# Altium project MASTER_HW.PrjPcb (part 3 of 4)

## Sheet [2] MCU.SchDoc
size A4; DocumentNumber: 2; SheetNumber: 3; SheetTotal: 10
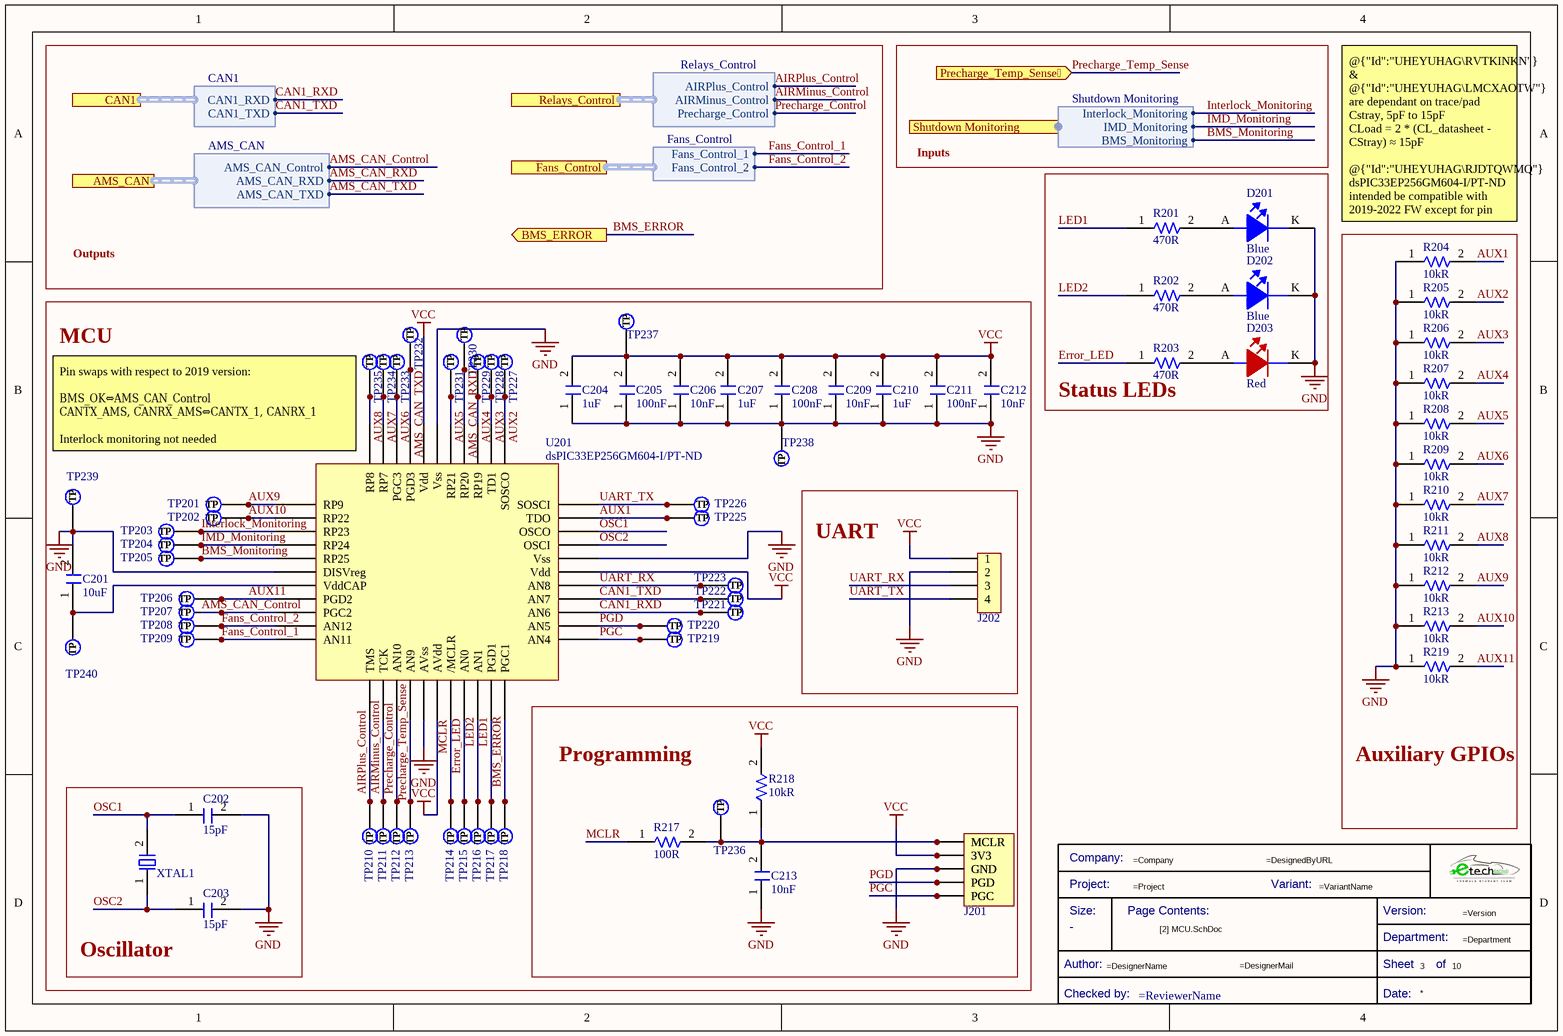
[diagram p3: [2] MCU.SchDoc]

### Parts
(Parts that share a designator on the sheet are numbered #1, #2 ... from top to bottom, then left to right.)
*#3  Title Block_template  (value not drawn)  (graphical)
C201  Capacitance: 10uF  [C1206FNPC-RW]  (hidden comment: 885012208018)
C202  Capacitance: 15pF  [C0805FNPC-R]  (hidden comment: 885012007052)
C203  Capacitance: 15pF  [C0805FNPC-R]  (hidden comment: 885012007052)
C204  Capacitance: 1uF  [C0805FNPC-R]  (hidden comment: 885012207103)
C205  Capacitance: 100nF  [C0805FNPC-R]  (hidden comment: 885012207098)
C206  Capacitance: 10nF  [C0805FNPC-R]  (hidden comment: 885012207092)
C207  Capacitance: 1uF  [C0805FNPC-R]  (hidden comment: 885012207103)
C208  Capacitance: 100nF  [C0805FNPC-R]  (hidden comment: 885012207098)
C209  Capacitance: 10nF  [C0805FNPC-R]  (hidden comment: 885012207092)
C210  Capacitance: 1uF  [C0805FNPC-R]  (hidden comment: 885012207103)
C211  Capacitance: 100nF  [C0805FNPC-R]  (hidden comment: 885012207098)
C212  Capacitance: 10nF  [C0805FNPC-R]  (hidden comment: 885012207092)
C213  Capacitance: 10nF  [C0805FNPC-R]  (hidden comment: 885012207092)
D201  Color: Blue  [LED_0805_WE]  (hidden comment: 150080BS75000)
D202  Color: Blue  [LED_0805_WE]  (hidden comment: 150080BS75000)
D203  Color: Red  [LED_0805_WE]  (hidden comment: 150080RS75000)
J201  61300511121  [J_PinHeader_1x5]  (value not drawn)
J202  61300411121  [J_PinHeader_1x4]  (value not drawn)
R201  Resistance: 470R  [R0805FTK]  (hidden comment: CR0805-FX-4700GLF)
R202  Resistance: 470R  [R0805FTK]  (hidden comment: CR0805-FX-4700GLF)
R203  Resistance: 470R  [R0805FTK]  (hidden comment: CR0805-FX-4700GLF)
R204  Resistance: 10kR  [R0805FTK]  (hidden comment: CR0805-JW-103ELF)
R205  Resistance: 10kR  [R0805FTK]  (hidden comment: CR0805-JW-103ELF)
R206  Resistance: 10kR  [R0805FTK]  (hidden comment: CR0805-JW-103ELF)
R207  Resistance: 10kR  [R0805FTK]  (hidden comment: CR0805-JW-103ELF)
R208  Resistance: 10kR  [R0805FTK]  (hidden comment: CR0805-JW-103ELF)
R209  Resistance: 10kR  [R0805FTK]  (hidden comment: CR0805-JW-103ELF)
R210  Resistance: 10kR  [R0805FTK]  (hidden comment: CR0805-JW-103ELF)
R211  Resistance: 10kR  [R0805FTK]  (hidden comment: CR0805-JW-103ELF)
R212  Resistance: 10kR  [R0805FTK]  (hidden comment: CR0805-JW-103ELF)
R213  Resistance: 10kR  [R0805FTK]  (hidden comment: CR0805-JW-103ELF)
R217  Resistance: 100R  [R0805FTK]  (hidden comment: CR0805-FX-1000ELF)
R218  Resistance: 10kR  [R0805FTK]  (hidden comment: CR0805-JW-103ELF)
R219  Resistance: 10kR  [R0805FTK]  (hidden comment: CR0805-JW-103ELF)
TP201  TestPoint  [TestPoint]  (value not drawn)  (no BOM)
TP202  TestPoint  [TestPoint]  (value not drawn)  (no BOM)
TP203  TestPoint  [TestPoint]  (value not drawn)  (no BOM)
TP204  TestPoint  [TestPoint]  (value not drawn)  (no BOM)
TP205  TestPoint  [TestPoint]  (value not drawn)  (no BOM)
TP206  TestPoint  [TestPoint]  (value not drawn)  (no BOM)
TP207  TestPoint  [TestPoint]  (value not drawn)  (no BOM)
TP208  TestPoint  [TestPoint]  (value not drawn)  (no BOM)
TP209  TestPoint  [TestPoint]  (value not drawn)  (no BOM)
TP210  TestPoint  [TestPoint]  (value not drawn)  (no BOM)
TP211  TestPoint  [TestPoint]  (value not drawn)  (no BOM)
TP212  TestPoint  [TestPoint]  (value not drawn)  (no BOM)
TP213  TestPoint  [TestPoint]  (value not drawn)  (no BOM)
TP214  TestPoint  [TestPoint]  (value not drawn)  (no BOM)
TP215  TestPoint  [TestPoint]  (value not drawn)  (no BOM)
TP216  TestPoint  [TestPoint]  (value not drawn)  (no BOM)
TP217  TestPoint  [TestPoint]  (value not drawn)  (no BOM)
TP218  TestPoint  [TestPoint]  (value not drawn)  (no BOM)
TP219  TestPoint  [TestPoint]  (value not drawn)  (no BOM)
TP220  TestPoint  [TestPoint]  (value not drawn)  (no BOM)
TP221  TestPoint  [TestPoint]  (value not drawn)  (no BOM)
TP222  TestPoint  [TestPoint]  (value not drawn)  (no BOM)
TP223  TestPoint  [TestPoint]  (value not drawn)  (no BOM)
TP225  TestPoint  [TestPoint]  (value not drawn)  (no BOM)
TP226  TestPoint  [TestPoint]  (value not drawn)  (no BOM)
TP227  TestPoint  [TestPoint]  (value not drawn)  (no BOM)
TP228  TestPoint  [TestPoint]  (value not drawn)  (no BOM)
TP229  TestPoint  [TestPoint]  (value not drawn)  (no BOM)
TP230  TestPoint  [TestPoint]  (value not drawn)  (no BOM)
TP231  TestPoint  [TestPoint]  (value not drawn)  (no BOM)
TP232  TestPoint  [TestPoint]  (value not drawn)  (no BOM)
TP233  TestPoint  [TestPoint]  (value not drawn)  (no BOM)
TP234  TestPoint  [TestPoint]  (value not drawn)  (no BOM)
TP235  TestPoint  [TestPoint]  (value not drawn)  (no BOM)
TP236  TestPoint  [TestPoint]  (value not drawn)  (no BOM)
TP237  TestPoint  [TestPoint]  (value not drawn)  (no BOM)
TP238  TestPoint  [TestPoint]  (value not drawn)  (no BOM)
TP239  TestPoint  [TestPoint]  (value not drawn)  (no BOM)
TP240  TestPoint  [TestPoint]  (value not drawn)  (no BOM)
U201  Supplier Part Number 1: dsPIC33EP256GM604-I/PT-ND  [U_dsPIC33EP256GM604-I/PT]  (hidden comment: dsPIC33EP256GM604-I/PT)
XTAL1  830028710  [XTAL20M_SMD]  (value not drawn)

### Blocks framed on the sheet
Status LEDs: D201-D203 R201-R203
Auxiliary GPIOs: R204-R213 R219
MCU: C201 C204-C212 TP201-TP223 TP225-TP235 TP237-TP240 U201
UART: J202
Programming: C213 J201 R217 R218 TP236
Oscillator: C202 C203 XTAL1

### Ports
AMS_CAN (harness AMS_CAN), BMS_ERROR (out), CAN1 (harness CAN1), Fans_Control (harness Fans_Control), Precharge_Temp_Sense (in), Relays_Control (harness Relays_Control), Shutdown Monitoring (harness Shutdown Monitoring)

### Harnesses
CAN1: CAN1_RXD, CAN1_TXD
AMS_CAN: AMS_CAN_Control, AMS_CAN_RXD, AMS_CAN_TXD
Relays_Control: AIRMinus_Control, AIRPlus_Control, Precharge_Control
Fans_Control: Fans_Control_1, Fans_Control_2
Shutdown Monitoring: BMS_Monitoring, IMD_Monitoring, Interlock_Monitoring

### Nets
GND: C201.2 C202.2 C203.2 C204.1 C205.1 C206.1 C207.1 C208.1 C209.1 C210.1 C211.1 C212.1 C213.1 D201.K D202.K D203.K J201.3(GND) J202.2 R204.1 R205.1 R206.1 R207.1 R208.1 R209.1 R210.1 R211.1 R212.1 R213.1 R219.1 TP238.1(TP) TP239.1(TP) U201.6(DISVreg) U201.16(AVss) U201.29(Vss) U201.39(Vss)
VCC: C204.2 C205.2 C206.2 C207.2 C208.2 C209.2 C210.2 C211.2 C212.2 J201.2(3V3) J202.1 R218.2 TP237.1(TP) U201.17(AVdd) U201.28(Vdd) U201.40(Vdd)
AIRMinus_Control: TP211.1(TP) U201.13(TCK) ; port Relays_Control.AIRMinus_Control
AIRPlus_Control: TP210.1(TP) U201.12(TMS) ; port Relays_Control.AIRPlus_Control
AMS_CAN_Control: TP207.1(TP) U201.9(PGC2) ; port AMS_CAN.AMS_CAN_Control
AMS_CAN_RXD: TP230.1(TP) U201.37(RP20) ; port AMS_CAN.AMS_CAN_RXD
AMS_CAN_TXD: TP232.1(TP) U201.41(PGD3) ; port AMS_CAN.AMS_CAN_TXD
AUX1: R204.2 TP225.1(TP) U201.32(TDO)
AUX2: R205.2 TP227.1(TP) U201.34(SOSCO)
AUX3: R206.2 TP228.1(TP) U201.35(TD1)
AUX4: R207.2 TP229.1(TP) U201.36(RP19)
AUX5: R208.2 TP231.1(TP) U201.38(RP21)
AUX6: R209.2 TP233.1(TP) U201.42(PGC3)
AUX7: R210.2 TP234.1(TP) U201.43(RP7)
AUX8: R211.2 TP235.1(TP) U201.44(RP8)
AUX9: R212.2 TP201.1(TP) U201.1(RP9)
AUX10: R213.2 TP202.1(TP) U201.2(RP22)
AUX11: R219.2 TP206.1(TP) U201.8(PGD2)
BMS_ERROR: TP218.1(TP) U201.22(PGC1) ; port BMS_ERROR
BMS_Monitoring: TP205.1(TP) U201.5(RP25) ; port Shutdown Monitoring.BMS_Monitoring
CAN1_RXD: TP221.1(TP) U201.25(AN6) ; port CAN1.CAN1_RXD
CAN1_TXD: TP222.1(TP) U201.26(AN7) ; port CAN1.CAN1_TXD
Error_LED: R203.1 TP215.1(TP) U201.19(AN0)
Fans_Control_1: TP209.1(TP) U201.11(AN11) ; port Fans_Control.Fans_Control_1
Fans_Control_2: TP208.1(TP) U201.10(AN12) ; port Fans_Control.Fans_Control_2
IMD_Monitoring: TP204.1(TP) U201.4(RP24) ; port Shutdown Monitoring.IMD_Monitoring
Interlock_Monitoring: TP203.1(TP) U201.3(RP23) ; port Shutdown Monitoring.Interlock_Monitoring
LED1: R201.1 TP217.1(TP) U201.21(PGD1)
LED2: R202.1 TP216.1(TP) U201.20(AN1)
MCLR: R217.1 TP214.1(TP) U201.18(/MCLR)
OSC1: C202.1 U201.31(OSCO) XTAL1.2
OSC2: C203.1 U201.30(OSCI) XTAL1.1
PGC: J201.5(PGC) TP219.1(TP) U201.23(AN4)
PGD: J201.4(PGD) TP220.1(TP) U201.24(AN5)
Precharge_Control: TP212.1(TP) U201.14(AN10) ; port Relays_Control.Precharge_Control
Precharge_Temp_Sense: TP213.1(TP) U201.15(AN9) ; port Precharge_Temp_Sense
UART_RX: J202.3 TP223.1(TP) U201.27(AN8)
UART_TX: J202.4 TP226.1(TP) U201.33(SOSCI)
NetC201_1: C201.1 TP240.1(TP) U201.7(VddCAP)
NetC213_2: C213.2 J201.1(MCLR) R217.2 R218.1 TP236.1(TP)
NetD201_A: D201.A R201.2
NetD202_A: D202.A R202.2
NetD203_A: D203.A R203.2

### Notes on the sheet
- Inputs
- @{"Id":"UHEYUHAG\RVTKINKN"} & @{"Id":"UHEYUHAG\LMCXAOTW"} are dependant on trace/pad Cstray, 5pF to 15pF
  CLoad = 2 * (CL_datasheet - CStray) ≈ 15pF
  @{"Id":"UHEYUHAG\RJDTQWMQ"} dsPIC33EP256GM604-I/PT-ND intended be compatible with 2019-2022 FW except for pin swappings.
- Outputs
- Pin swaps with respect to 2019 version:
  BMS_OK⇔AMS_CAN_Control
  CANTX_AMS, CANRX_AMS⇔CANTX_1, CANRX_1
  Interlock monitoring not needed
- Title
- Size:
- Date:
- A4
- Number:
- Time:
- Revision:
- Sheet
- of
- File:
- (in symbol Title Block_template) Company:; Project:; Variant:; Size:; Page Contents:; Version:; Department:; Author:; Sheet; of; Checked by:; Date:

### Library data of the parts
*#3 = Title Block_template: Standard Title Block; Category: Title Block; Checked by:: =ReviewerName; Size: -
C201 = C10u-10V-1206FNPC-X7R: Cap, 10ΜF, 10V, 10%, X7R, 1206; Manufacturer 1: Wurth Electronics; .Creator: GP; Supplier 1: Digi-Key; Manufacturer Part Number 1: 885012208018; RoHS: Yes; Category: Ceramic Capacitors; Stock 1: 7; Pricing 1: 1=0,66000, 10=0,59800, 100=0,53600, 500=0,47400 (USD); Mount: Surface Mount; Case/Package: 1206; Case Code (Metric): 3216; Case Code (Imperial): 1206; Min Operating Temperature: -55°C; Max Operating Temperature: 125°C; Packaging: Tape and Reel; Voltage Rating: 10V; Tolerance: 10%; Length: 0.126inch; Width: 0.063inch; Thickness: 0.075inch; RoHS Compliant: Yes; ComponentLink1URL: http://www.farnell.com/datasheets/2031895.pdf?src-supplier=Farnell; ComponentLink1Description: http://www.farnell.com/datasheets/2031895.pdf?src-supplier=Farnell; ComponentLink2URL: https://katalog.we-online.de/pbs/datasheet/885012208018.pdf?src-supplier=Digi-Key; ComponentLink2Description: https://katalog.we-online.de/pbs/datasheet/885012208018.pdf?src-supplier=Digi-Key; ComponentLink3URL: http://www.farnell.com/datasheets/2031895.pdf?src-supplier=Newark; ComponentLink3Description: http://www.farnell.com/datasheets/2031895.pdf?src-supplier=Newark; Supplier Part Number 1: 732-7565-1-ND; ComponentLink4Description: Wurth Elektronik; ComponentLink4URL: https://www.we-online.com/catalog/en/WCAP-CSGP-10VDC?sq=885012208018#885012208018
C202 C203 = C15p-50V-0805FNPC-NP0: Cap, 15PF, 50V, 5%, C0G/NP0, 0805; Manufacturer 1: Wurth Electronics; .Creator: DR; Supplier 1: Newark; Manufacturer Part Number 1: 885012007052; RoHS: Yes; Category: Ceramic Capacitors; Stock 1: 815; Pricing 1: 1=0,10800, 10=0,05200, 25=0,05100, 50=0,04900, 100=0,04800, 250=0,04600, 500=0,04300 (USD); Mount: Surface Mount; Case/Package: 0805; Case Code (Metric): 2012; Case Code (Imperial): 0805; Min Operating Temperature: -55°C; Max Operating Temperature: 125°C; Packaging: Cut Tape; Voltage Rating: 50V; Tolerance: 5%; Length: 0.079inch; Width: 0.049inch; Thickness: 0.028inch; RoHS Compliant: Yes; ComponentLink1URL: http://www.farnell.com/datasheets/2031702.pdf?src-supplier=Farnell; ComponentLink1Description: http://www.farnell.com/datasheets/2031702.pdf?src-supplier=Farnell; ComponentLink2URL: http://katalog.we-online.de/pbs/datasheet/885012007052.pdf?src-supplier=Digi-Key; ComponentLink2Description: http://katalog.we-online.de/pbs/datasheet/885012007052.pdf?src-supplier=Digi-Key; ComponentLink3URL: https://katalog.we-online.de/pbs/datasheet/885012007052.pdf?src-supplier=Digi-Key; ComponentLink3Description: https://katalog.we-online.de/pbs/datasheet/885012007052.pdf?src-supplier=Digi-Key; Supplier Part Number 1: 15AC9316
C204 C207 C210 = C1u-50V-0805FNPC-X7R: Multilayer Ceramic Capacitor, Wcap-Csgp Series, 1 F, 10%, X7R, 50 V, 0805 [2012 Metric] Rohs Compliant: Yes; Manufacturer 1: Wurth Electronics; Voltage Rating: 50V; .Creator: GP; Supplier 1: RSComponents; Manufacturer Part Number 1: 885012207103; RoHS: Yes; Category: Ceramic Capacitors; Stock 1: 5100; Pricing 1: 50=0,27200, 250=0,25300, 500=0,22800, 1250=0,20100, 2500=0,17100 (GBP); Mount: Surface Mount; Case/Package: 0805; Case Code (Metric): 2012; Case Code (Imperial): 0805; Min Operating Temperature: -55°C; Max Operating Temperature: 85°C; Packaging: Cut Tape; Dielectric: X7R; Tolerance: 10%; Voltage Rating (DC): 50V; Length: 0.079inch; Width: 0.049inch; Thickness: 0.053inch; REACH SVHC: Unknown; RoHS Compliant: Yes; ComponentLink1URL: http://www.farnell.com/datasheets/1958501.pdf?src-supplier=Farnell; ComponentLink1Description: http://www.farnell.com/datasheets/1958501.pdf?src-supplier=Farnell; ComponentLink2URL: http://www.farnell.com/datasheets/1958501.pdf?src-supplier=Element14; ComponentLink2Description: http://www.farnell.com/datasheets/1958501.pdf?src-supplier=Element14; ComponentLink3URL: https://katalog.we-online.de/pbs/datasheet/885012107003.pdf?src-supplier=Digi-Key; ComponentLink3Description: https://katalog.we-online.de/pbs/datasheet/885012107003.pdf?src-supplier=Digi-Key; ComponentLink4URL: http://www.farnell.com/datasheets/1958501.pdf?src-supplier=Newark; ComponentLink4Description: http://www.farnell.com/datasheets/1958501.pdf?src-supplier=Newark; Supplier Part Number 1: 1813523
C205 C208 C211 = C100n-50V-0805FNPC-X7R: Cap, 0.1ΜF, 50V, 10%, X7R, 0805; Manufacturer 1: Wurth Electronics; .Creator: DR; Supplier 1: RSComponents; Manufacturer Part Number 1: 885012207098; RoHS: Yes; Category: Ceramic Capacitors; Stock 1: 8000; Pricing 1: 100=0,10200, 500=0,07100, 2000=0,06100 (GBP); Mount: Surface Mount; Case/Package: 0805; Case Code (Metric): 2012; Case Code (Imperial): 0805; Min Operating Temperature: -55°C; Max Operating Temperature: 125°C; Packaging: Cut Tape; Voltage Rating: 50V; Dielectric: X7R; Tolerance: 10%; Voltage Rating (DC): 50V; Length: 0.079inch; Width: 0.049inch; Thickness: 0.035inch; REACH SVHC: Unknown; RoHS Compliant: Yes; ComponentLink1URL: http://www.farnell.com/datasheets/1958498.pdf?src-supplier=Farnell; ComponentLink1Description: http://www.farnell.com/datasheets/1958498.pdf?src-supplier=Farnell; ComponentLink2URL: http://www.farnell.com/datasheets/1958498.pdf?src-supplier=Element14; ComponentLink2Description: http://www.farnell.com/datasheets/1958498.pdf?src-supplier=Element14; ComponentLink3URL: https://katalog.we-online.de/pbs/datasheet/885012207098.pdf?src-supplier=Digi-Key; ComponentLink3Description: https://katalog.we-online.de/pbs/datasheet/885012207098.pdf?src-supplier=Digi-Key; ComponentLink4URL: http://www.farnell.com/datasheets/1958498.pdf?src-supplier=Newark; ComponentLink4Description: http://www.farnell.com/datasheets/1958498.pdf?src-supplier=Newark; Supplier Part Number 1: 1813493
C206 C209 C212 C213 = C10n-50V-0805FNPC-X7R: Cap, 0.01ΜF, 50V, 10%, X7R, 0805; Manufacturer 1: Wurth Electronics; .Creator: DR; Supplier 1: RSComponents; Manufacturer Part Number 1: 885012207092; RoHS: Yes; Category: Ceramic Capacitors; Stock 1: 1; Pricing 1: 4000=0,03200, 12000=0,03100 (USD); Mount: Surface Mount; Case/Package: 0805; Case Code (Metric): 2012; Case Code (Imperial): 0805; Min Operating Temperature: -55°C; Max Operating Temperature: 125°C; Packaging: Cut Tape; Voltage Rating: 50V; Dielectric: X7R; Tolerance: 10%; Voltage Rating (DC): 50V; Length: 0.079inch; Width: 0.049inch; Thickness: 0.035inch; REACH SVHC: Unknown; RoHS Compliant: Yes; ComponentLink1URL: http://www.farnell.com/datasheets/1958497.pdf?src-supplier=Farnell; ComponentLink1Description: http://www.farnell.com/datasheets/1958497.pdf?src-supplier=Farnell; ComponentLink2URL: http://www.farnell.com/datasheets/1958497.pdf?src-supplier=Element14; ComponentLink2Description: http://www.farnell.com/datasheets/1958497.pdf?src-supplier=Element14; ComponentLink3URL: http://www.farnell.com/datasheets/1958497.pdf?src-supplier=Newark; ComponentLink3Description: http://www.farnell.com/datasheets/1958497.pdf?src-supplier=Newark; ComponentLink4URL: https://katalog.we-online.de/pbs/datasheet/885012207092.pdf?src-supplier=Digi-Key; ComponentLink4Description: https://katalog.we-online.de/pbs/datasheet/885012207092.pdf?src-supplier=Digi-Key; Supplier Part Number 1: 1813941
D201 D202 = LEDBS-0805-145: LED BLUE CLEAR 0805 SMD; Manufacturer 1: Wurth Electronics; Luminous Intensity: 145mcd; Viewing Angle: 140°; Forward Voltage: 3.2V; Wavelength: 470nm; Lens Style: Clear,Rectangular; Forward Current: 30mA; Test Current: 20mA; .Creator: GP; ComponentLink1Description: Datasheet; ComponentLink1URL: https://www.we-online.com/catalog/datasheet/150080BS75000.pdf; ComponentLink2Description: Where buy it; ComponentLink2URL: https://katalog.we-online.de/en/led/WL-SMCW/150080BS75000; Supplier 1: RSComponents; Manufacturer Part Number 1: 150080BS75000; RoHS: Yes; Category: LEDs; Stock 1: 7400; Pricing 1: 50=0,19300, 500=0,12900, 1000=0,12200, 2000=0,11700, 4000=0,11100 (USD); Mount: Surface Mount; Case/Package: 0805; Case Code (Metric): 2012; Case Code (Imperial): 0805; Min Operating Temperature: -40°C; Max Operating Temperature: 85°C; Package Quantity: 4000; Packaging: Tape and Reel; Dominant Wavelength: 470nm; Length: 2mm; Width: 1.25mm; Height: 0.7mm; REACH SVHC: Unknown; RoHS Compliant: Yes; Lead Free: Lead Free; ComponentLink3URL: https://datasheet.ciiva.com/23843/150080bs75000-23843251.pdf?src-supplier=Newark; ComponentLink3Description: https://datasheet.ciiva.com/23843/150080bs75000-23843251.pdf?src-supplier=Newark; ComponentLink4URL: https://datasheet.ciiva.com/22656/1740214-22656954.pdf?src-supplier=Element14; ComponentLink4Description: https://datasheet.ciiva.com/22656/1740214-22656954.pdf?src-supplier=Element14; ComponentLink5URL: https://datasheet.ciiva.com/29279/759433-da-01-en-chipled-0805-w-kl-blau-150080bs75000-29279203.pdf?src-supplier=Conrad; ComponentLink5Description: https://datasheet.ciiva.com/29279/759433-da-01-en-chipled-0805-w-kl-blau-150080bs75000-29279203.pdf?src-supplier=Conrad; ComponentLink6URL: https://datasheet.ciiva.com/29562/150080bs75000-29562922.pdf?src-supplier=Digi-Key; ComponentLink6Description: https://datasheet.ciiva.com/29562/150080bs75000-29562922.pdf?src-supplier=Digi-Key; ComponentLink7URL: https://datasheet.ciiva.com/29562/150080bs75000-29562923.pdf?src-supplier=Digi-Key; ComponentLink7Description: https://datasheet.ciiva.com/29562/150080bs75000-29562923.pdf?src-supplier=Digi-Key; Supplier Part Number 1: 8154228
D203 = LEDRS-0805-150: 0805(H=0.8mm) 红色 高亮 λD=625nm VF=2V IF=30mA PD=72mW; Manufacturer 1: Wurth Electronics; Luminous Intensity: 150mcd; Viewing Angle: 140°; Forward Voltage: 2V; Wavelength: 625nm; Lens Style: Clear,Rectangular; Forward Current: 30mA; Test Current: 20mA; .Creator: DR; ComponentLink1Description: Datasheet; ComponentLink1URL: https://www.we-online.com/catalog/datasheet/150080RS75000.pdf; ComponentLink2Description: Where buy it; ComponentLink2URL: https://katalog.we-online.de/en/led/WL-SMCW/150080RS75000; Supplier 1: RSComponents; Manufacturer Part Number 1: 150080RS75000; RoHS: Yes; Category: LEDs; Stock 1: 1; Pricing 1: 50=0,19300, 500=0,12900, 1000=0,12300, 2000=0,11700, 4000=0,11100 (USD); Mount: Surface Mount; Case/Package: 0805; Case Code (Metric): 2012; Case Code (Imperial): 0805; Min Operating Temperature: -40°C; Max Operating Temperature: 85°C; Package Quantity: 4000; Packaging: Tape and Reel; Dominant Wavelength: 625nm; Length: 2mm; Width: 1.25mm; Height: 0.7mm; REACH SVHC: Unknown; RoHS Compliant: Yes; ComponentLink3URL: https://datasheet.ciiva.com/22656/150080rs75000-22656961.pdf?src-supplier=Element14; ComponentLink3Description: https://datasheet.ciiva.com/22656/150080rs75000-22656961.pdf?src-supplier=Element14; ComponentLink4URL: https://datasheet.ciiva.com/29279/759435-da-01-en-chipled-0805-w-kl-rot-150080rs75000-29279032.pdf?src-supplier=Conrad; ComponentLink4Description: https://datasheet.ciiva.com/29279/759435-da-01-en-chipled-0805-w-kl-rot-150080rs75000-29279032.pdf?src-supplier=Conrad; Supplier Part Number 1: 8154225P
J201 = J_Pickit3: THT Vertical Pin Header WR-PHD, Pitch 2.54 mm, Single Row, 5 pins; Manufacturer: Molex; Temperature rating: -40° to +105°C; Category type: PCB-PCB; Maximum current: 3 A; Maximum voltage: 250 V AC; Connections: 1x5; Number of Positions: 5; Gender: Male; Connector Type: Male Pin; Pitch: 0.1inch; .Creator: GP; Category: Connector; ComponentLink1Description: Datasheet; ComponentLink1URL: https://www.we-online.com/catalog/datasheet/61300511121.pdf; ComponentLink2Description: Where buy it; ComponentLink2URL: https://www.we-online.com/catalog/en/PHD_2_54_THT_PIN_HEADER_6130XX11121?sq=61300511121&sp=https%3A%2F%2Fwww.we-online.com%2Fweb%2Fen%2Fwuerth_elektronik%2Fsearchpage.php%3Fsearch%3D61300511121#61300511121; Manufacturer part number: 61300511121; Supplier: Würth Elektronik; RoHS: *; Application: Charge program; Product name: Pin Header; Flammability: 94V-0; Orientation: vertical; Mount: Through hole; Supplier 1: Mouser; Stock 1: 1878; Pricing 1: 1=0,26000, 10=0,21600, 25=0,18000, 50=0,15000, 100=0,13700, 1000=0,12400, 10000=0,12400 (USD); Contact Plating: Gold; Contact Material: Copper; Color: Black; Number of Rows: 1; Packaging: Bulk; Termination: Solder; Number of Contacts: 5; Contact Mating Length: 0.236inch; REACH SVHC: Unknown; Lead Free: Lead Free; ComponentLink3URL: http://www.farnell.com/cad/1737268.pdf?src-supplier=Element14; ComponentLink3Description: http://www.farnell.com/cad/1737268.pdf?src-supplier=Element14; ComponentLink4URL: https://katalog.we-online.de/em/datasheet/6130xx11121.pdf?src-supplier=Digi-Key; ComponentLink4Description: https://katalog.we-online.de/em/datasheet/6130xx11121.pdf?src-supplier=Digi-Key; Supplier Part Number 1: 710-61300511121
J202 = J_UART: CONN HEADER 4 POS 2.54; Manufacturer 1: Wurth Electronics; Number of Positions: 4; Gender: Male; Connector Type: Male Pin; Pitch: 0.1inch; .Creator: AC; Supplier 1: RSComponents; Manufacturer Part Number 1: 61300411121; RoHS: Yes; Category: Headers and Wire Housings; Stock 1: 1; Pricing 1: 5=0,19500, 250=0,08000, 500=0,07700, 2500=0,07500, 5000=0,07200 (USD); Mount: Through Hole; Contact Plating: Gold; Contact Material: Copper; Color: Black; Number of Rows: 1; Packaging: Bulk; Termination: Solder; Number of Contacts: 4; Contact Mating Length: 0.236inch; REACH SVHC: Unknown; Lead Free: Lead Free; RoHS Compliant: Yes; ComponentLink1URL: http://www.farnell.com/cad/1737268.pdf?src-supplier=Element14; ComponentLink1Description: http://www.farnell.com/cad/1737268.pdf?src-supplier=Element14; ComponentLink2URL: https://katalog.we-online.de/em/datasheet/6130xx11121.pdf?src-supplier=Digi-Key; ComponentLink2Description: https://katalog.we-online.de/em/datasheet/6130xx11121.pdf?src-supplier=Digi-Key; Supplier Part Number 1: 8281594
R201-R203 = R470-0805FTK: Res Thick Film 0805 470 Ohm 1% 1/8W ±100ppm/°C Molded SMD SMD Paper Tape on Plastic Reel; Manufacturer 1: Bourns; Power Rating: 125mW; Voltage Rating: 150V; .Creator: DR; Supplier 1: Arrow Electronics; Manufacturer Part Number 1: CR0805-FX-4700GLF; RoHS: Yes; Category: Chip SMD Resistors; Stock 1: 12623; Pricing 1: 1=0,00990, 10=0,00980, 25=0,00950, 50=0,00940, 100=0,00930, 250=0,00920, 500=0,00910, 1000=0,00890, 3000=0,00870, 6000=0,00860 (USD); Mount: Surface Mount; Case/Package: 0805; Number of Pins: 2; Case Code (Imperial): 0805; Case Code (Metric): 2012; Contact Plating: Tin; Min Operating Temperature: -55°C; Max Operating Temperature: 155°C; Packaging: Tape and Reel; Tolerance: 1%; Resistor Type: Thick Film; Termination: SMD/SMT; Temperature Coefficient: 100ppm/°C; Voltage Rating (DC): 150V; Features: Moisture Resistant; Series: CR0805; Max Power Dissipation: 125mW; Number of Terminations: 2; Resistance Tolerance: 1%; Construction: Rectangular; Technology: THICK FILM; Length: 2mm; Height: 0.5mm; Depth: 1.25mm; Thickness: 508um; Radiation Hardening: No; REACH SVHC: No SVHC; Military Standard: Not; ComponentLink1URL: https://datasheet.ciiva.com/11808/0900766b80fcdb72-11808686.pdf?src-supplier=RSComponents; ComponentLink1Description: https://datasheet.ciiva.com/11808/0900766b80fcdb72-11808686.pdf?src-supplier=RSComponents; ComponentLink2URL: https://datasheet.ciiva.com/7985/1856384-7985880.pdf?src-supplier=Element14; ComponentLink2Description: https://datasheet.ciiva.com/7985/1856384-7985880.pdf?src-supplier=Element14; ComponentLink3URL: https://datasheet.ciiva.com/22693/1902866-22693247.pdf?src-supplier=Element14; ComponentLink3Description: https://datasheet.ciiva.com/22693/1902866-22693247.pdf?src-supplier=Element14; ComponentLink4URL: https://datasheet.ciiva.com/5541/chpreztr-5541930.pdf?src-supplier=Mouser; ComponentLink4Description: https://datasheet.ciiva.com/5541/chpreztr-5541930.pdf?src-supplier=Mouser; Supplier Part Number 1: CR0805-FX-4700GLF
R204-R213 R218 R219 = R10k-0805FTK: BOURNS         CR0805-JW-103ELF            Surface Mount Chip Resistor, Thick Film, CR Series, 10 kohm, 125 mW,  5%, 150 V; Temperature Coefficient: 200ppm/°C; Power Rating: 125mW; Voltage Rating: 150V; Voltage Rating (DC): 100V; .Creator: DR; Supplier 1: Arrow Electronics; Manufacturer 1: Bourns; Manufacturer Part Number 1: CR0805-JW-103ELF; RoHS: Yes; Category: Chip SMD Resistors; Stock 1: 57566; Pricing 1: 1=0,05790, 10=0,01540, 25=0,01340, 100=0,00340 (USD); Mount: Surface Mount; Case/Package: 0805; Number of Pins: 2; Contact Plating: Tin; Case Code (Metric): 2012; Case Code (Imperial): 0805; Min Operating Temperature: -55°C; Max Operating Temperature: 155°C; Tolerance: 5%; Resistor Type: Thick Film; Package Quantity: 1; Packaging: Tape and Reel; Number of Terminations: 2; Termination: SMD/SMT; Max Power Dissipation: 125mW; Features: Moisture Resistant; Series: CR0805; Construction: Rectangular; Resistance Tolerance: 5%; Technology: THICK FILM; Length: 2mm; Width: 1.25mm; Height: 0.5mm; Depth: 1.25mm; Thickness: 508um; Radiation Hardening: No; REACH SVHC: No SVHC; Military Standard: Not; RoHS Compliant: Yes; ComponentLink1URL: https://datasheet.ciiva.com/11821/0900766b80fcdb72-11821135.pdf?src-supplier=RSComponents; ComponentLink1Description: https://datasheet.ciiva.com/11821/0900766b80fcdb72-11821135.pdf?src-supplier=RSComponents; ComponentLink2URL: https://datasheet.ciiva.com/9122/chpreztr-9122374.pdf?src-supplier=Avnet; ComponentLink2Description: https://datasheet.ciiva.com/9122/chpreztr-9122374.pdf?src-supplier=Avnet; ComponentLink3URL: https://datasheet.ciiva.com/22693/1902866-22693254.pdf?src-supplier=Element14; ComponentLink3Description: https://datasheet.ciiva.com/22693/1902866-22693254.pdf?src-supplier=Element14; ComponentLink4URL: https://datasheet.ciiva.com/7986/691949-7986187.pdf?src-supplier=Element14; ComponentLink4Description: https://datasheet.ciiva.com/7986/691949-7986187.pdf?src-supplier=Element14; ComponentLink5URL: https://datasheet.ciiva.com/30065/159chpreztr-30065976.pdf?src-supplier=Onlinecomponents.com; ComponentLink5Description: https://datasheet.ciiva.com/30065/159chpreztr-30065976.pdf?src-supplier=Onlinecomponents.com; ComponentLink6URL: https://datasheet.ciiva.com/16783/70154685-16783482.pdf?src-supplier=Allied+Electronics; ComponentLink6Description: https://datasheet.ciiva.com/16783/70154685-16783482.pdf?src-supplier=Allied+Electronics; ComponentLink7URL: https://datasheet.ciiva.com/5548/chpreztr-5548491.pdf?src-supplier=Mouser; ComponentLink7Description: https://datasheet.ciiva.com/5548/chpreztr-5548491.pdf?src-supplier=Mouser; ComponentLink8URL: https://datasheet.ciiva.com/6559/chpreztr-6559900.pdf?src-supplier=Digi-Key; ComponentLink8Description: https://datasheet.ciiva.com/6559/chpreztr-6559900.pdf?src-supplier=Digi-Key; ComponentLink9URL: https://datasheet.ciiva.com/6559/chpreztr-6559901.pdf?src-supplier=Digi-Key; ComponentLink9Description: https://datasheet.ciiva.com/6559/chpreztr-6559901.pdf?src-supplier=Digi-Key; ComponentLink10URL: https://datasheet.ciiva.com/7985/1856384-7985869.pdf?src-supplier=Element14; ComponentLink10Description: https://datasheet.ciiva.com/7985/1856384-7985869.pdf?src-supplier=Element14; ComponentLink11URL: https://datasheet.ciiva.com/48692/001055517-da-01-en-smd-wid-cr0805-jw-103elf-10k-ohm-1-8w-48692118.pdf?src-supplier=Conrad; ComponentLink11Description: https://datasheet.ciiva.com/48692/001055517-da-01-en-smd-wid-cr0805-jw-103elf-10k-ohm-1-8w-48692118.pdf?src-supplier=Conrad; Supplier Part Number 1: CR0805-JW-103ELF
R217 = R100-0805FTK: Res Thick Film 0805 100 Ohm 1% 1/8W ±100ppm/°C Molded SMD SMD Paper Tape on Plastic Reel; Manufacturer 1: Bourns; Power Rating: 125mW; Voltage Rating: 150V; .Creator: DR; Supplier 1: Arrow Electronics; Manufacturer Part Number 1: CR0805-FX-1000ELF; RoHS: Yes; Category: Chip SMD Resistors; Stock 1: 49802; Pricing 1: 1=0,05840, 10=0,03430, 25=0,01780, 100=0,00750, 250=0,00560, 500=0,00490, 3000=0,00470 (USD); Mount: Surface Mount; Case/Package: 0805; Number of Pins: 2; Contact Plating: Tin; Case Code (Imperial): 0805; Case Code (Metric): 2012; Min Operating Temperature: -55°C; Max Operating Temperature: 155°C; Tolerance: 1%; Resistor Type: Thick Film; Temperature Coefficient: 100ppm/°C; Packaging: Tape and Reel; Package Quantity: 1; Termination: SMD/SMT; Number of Terminations: 2; Max Power Dissipation: 125mW; Voltage Rating (DC): 150V; Features: Moisture Resistant; Series: CR0805; Resistance Tolerance: 1%; Construction: Rectangular; Technology: THICK FILM; Length: 2mm; Width: 1.25mm; Height: 0.5mm; Depth: 1.25mm; Thickness: 508um; Radiation Hardening: No; REACH SVHC: No SVHC; Military Standard: Not; RoHS Compliant: Yes; ComponentLink1URL: https://datasheet.ciiva.com/11809/0900766b80fcdb72-11809178.pdf?src-supplier=RSComponents; ComponentLink1Description: https://datasheet.ciiva.com/11809/0900766b80fcdb72-11809178.pdf?src-supplier=RSComponents; ComponentLink2URL: https://datasheet.ciiva.com/6547/chpreztr-6547413.pdf?src-supplier=Digi-Key; ComponentLink2Description: https://datasheet.ciiva.com/6547/chpreztr-6547413.pdf?src-supplier=Digi-Key; ComponentLink3URL: https://datasheet.ciiva.com/6547/chpreztr-6547414.pdf?src-supplier=Digi-Key; ComponentLink3Description: https://datasheet.ciiva.com/6547/chpreztr-6547414.pdf?src-supplier=Digi-Key; ComponentLink4URL: https://datasheet.ciiva.com/6547/chpreztr-6547415.pdf?src-supplier=Digi-Key; ComponentLink4Description: https://datasheet.ciiva.com/6547/chpreztr-6547415.pdf?src-supplier=Digi-Key; ComponentLink5URL: https://datasheet.ciiva.com/9120/chpreztr-9120744.pdf?src-supplier=Avnet; ComponentLink5Description: https://datasheet.ciiva.com/9120/chpreztr-9120744.pdf?src-supplier=Avnet; Supplier Part Number 1: CR0805-FX-1000ELF
TP201-TP223 TP225-TP240 = TestPoint: Test Point 1x1 mm; .Creator: GP; Category: TestPoint; .PCBcheck: GP; .SCHcheck: GP
U201 = U_dsPIC33EP256GM604-I/PT: 16-bit MCU/DSC, 256 KB, 32768 Bytes, 70 MHz, 3 to 3.6V, TQFP-44, RoHS; Manufacturer 1: Microchip; Number of ADC Channels: 18; RAM Size: 32KB; .Creator: DR; ComponentLink1Description: Datasheet; ComponentLink1URL: https://datasheet.ciiva.com/18628/dspic33epxxxgm3xx6xx7xxdatasheet-18628712.pdf?src-supplier=Digi-Key; ComponentLink2Description: Where buy it; ComponentLink2URL: *; Supplier 1: Digi-Key; RoHS: Yes; Category: Microcontrollers; Pricing 1: 160=6,16500 (USD); Case/Package: TQFP; Number of Pins: 44; Min Operating Temperature: -40°C; Max Operating Temperature: 85°C; Package Quantity: 160; Packaging: Tray; RoHS Compliant: Yes; ComponentLink3URL: https://datasheet.ciiva.com/18628/dspic33epxxxgm3xx6xx7xxdatasheet-18628712.pdf?src-supplier=Digi-Key; ComponentLink3Description: https://datasheet.ciiva.com/18628/dspic33epxxxgm3xx6xx7xxdatasheet-18628712.pdf?src-supplier=Digi-Key; Manufacturer Part Number 1: dsPIC33EP256GM604-I/PT
XTAL1 = XTAL20M_SMD: 830028710, 20 MHz; Manufacturer: Würth Elektronik; Frequency: 20 MHz; Frequency Stability: +-50 ppm; Drive level: 500µW max; .Creator: GP; Category: XTAL; ComponentLink1Description: Datasheet; ComponentLink1URL: https://www.we-online.com/catalog/datasheet/830028710.pdf; ComponentLink2Description: Where buy it; Package: *; Manufacturer part number: 830028710; Supplier: Würth Elektronik; Packaging: Reel; Max operating temperature.: 85ºC; Min operating temperature: -40ºC; Max power dissipation: *; Power rating: *; RoHS: Yes; Number of pins: 2; Type: SMD; Supplier 1: Digi-Key; Stock 1: 975; Pricing 1: 1=0,37000, 10=0,28100, 50=0,26800, 100=0,24400, 500=0,22000 (USD); Supplier Part Number 1: 1923-830028710CT-ND